# EAGLE design HelloWorldSMD (EAGLE 7.3.0)
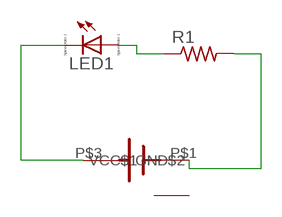
[diagram p0: schematic, sheet 1]

## Parts
LED1  LED_E  [LED_1206]
R1  R-US_R0805  [R0805]
U$1  CR1025  [CR1025]

## Nets
N$2: LED1.A R1.1
N$4: LED1.C U$1.P$3(GND$2)
N$8: R1.2 U$1.P$1(VCC$1)

## Power pins joined to a net without a drawn wire
VCC: U$1.P$2(VCC)

## Library data of the parts
LED1 = eagle-ltspice:LED_E: LED Source: http://www.osram.convergy.de Source: www.luxeon.com Source: www.kingbright.com; SPICEMODEL: NONE; SPICEPREFIX: D; SPICETYPE: diode
R1 = adafruit:R-US_: RESISTOR, American symbol
U$1 = battery:CR1025

## Board
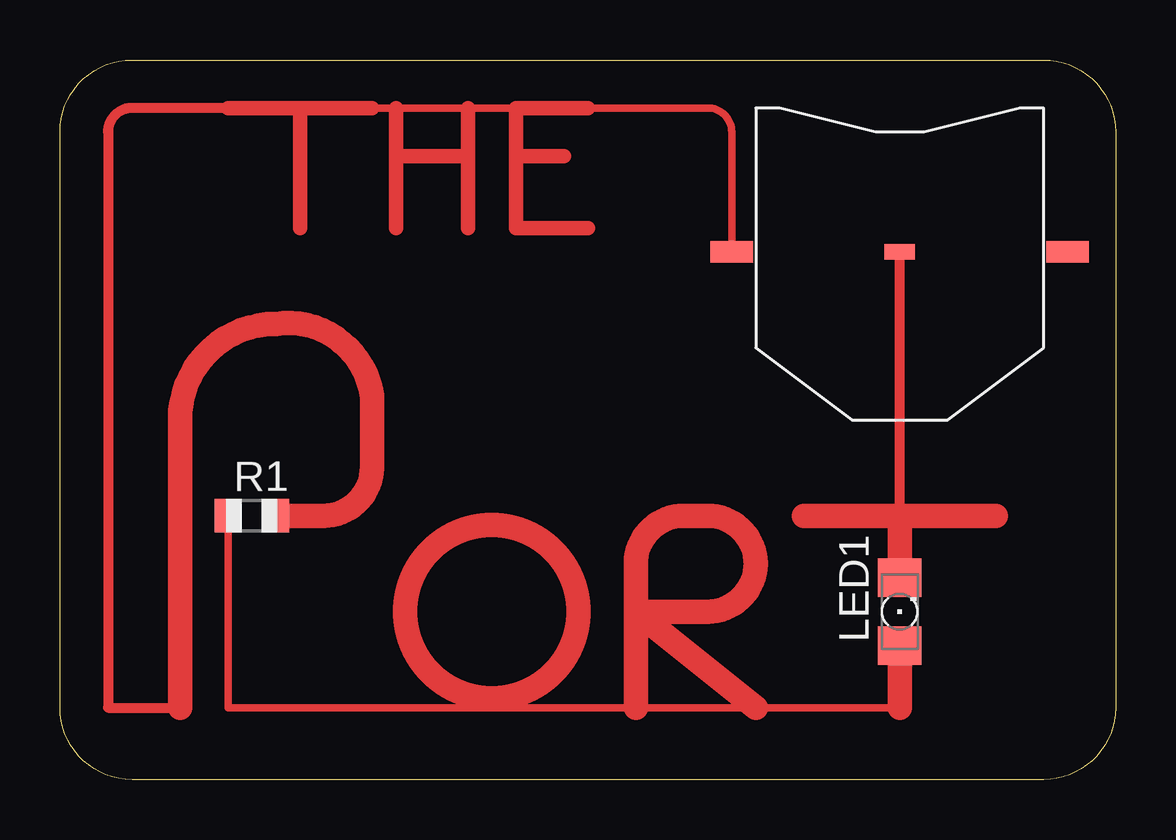
[diagram p1: board, top side]

Size 44 x 30 mm. Coordinates in mm from the lower left corner, seen from the top.
Outline: 0,27 arc-90 3,30 41,30 arc-90 44,27 44,3 arc-90 41,0 3,0 arc-90 0,3 0,27
Copper layers (1*16): Top 0.035mm / dielectric 1.5mm / Bottom 0.035mm
Design rules "default": minimum track width 10mil, minimum drill 24mil, track to track 8mil, track to pad 8mil, pad to pad 8mil, via to via 8mil, smd to smd 8mil, copper to edge 40mil, drill to drill 8mil, minimum pad ring 10mil, minimum via ring 8mil, stop-mask expansion 4mil, vias tented up to drill 0mil, thermal gap 10mil

### Footprints (pad centres in the part's own frame; a part is rotated, then mirrored left to right if it is on the bottom)
LED_1206 = smd 1.6 x 1.803: A -1.422,0; C 1.422,0
R0805 = smd 1.1 x 1.4: 1 -1,0; 2 1,0
CR1025 = smd 1.778 x 0.914: P$1 -7,0; P$2 7,0 | smd 1.27 x 0.635: P$3 0,0

### Placement (x,y rotation side)
LED1  35,7 90 top
R1  8,11 0 top
U$1  35,22 0 top

### Tracks (layer width: path | path; a pad name or v marks a point on that pad's centre or on a via)
N$2
  Top 0.305: 35,3 7,3 R1.1
  Top 1.016: LED1.A 35,3
N$4
  Top 0.406: LED1.C U$1.P$3
N$8
  Top 0.305: U$1.P$1 28,27 arc90 27,28 22,28 | 19,28 17,28 14,28 13,28
  Top 0.406: 7,28 3,28 arc90 2,27 2,3 5,3
  Top 0.61: 14,26 17,26 | 7,28 10,28 | 13,28 10,28 | 10,28 10,23 | 14,28 14,26 | 14,26 14,23 | 17,26 17,28 | 17,26 17,23 | 19,26 19,28 22,28 | 19,26 19,23 22,23 | 19,26 21,26
  Top 1.016: 5,3 5,15 arc-90 9,19 arc-90 13,16 13,13 arc-90 11,11 R1.2
N$9
  Top 1.016: 24,7 24,9 arc-90 26,11 27,11 arc-90 29,9 arc-90 27,7 24,7 | 24,7 24,3 | 24,7 29,3
N$10
  Top 1.016: 31,11 35,11 | 35,11 39,11 | 35,11 35,9
(copper drawn outside any net)
  shapes: Top circle x1